# EAGLE design module (EAGLE 9.4.0)

## Sheet 1 of 2
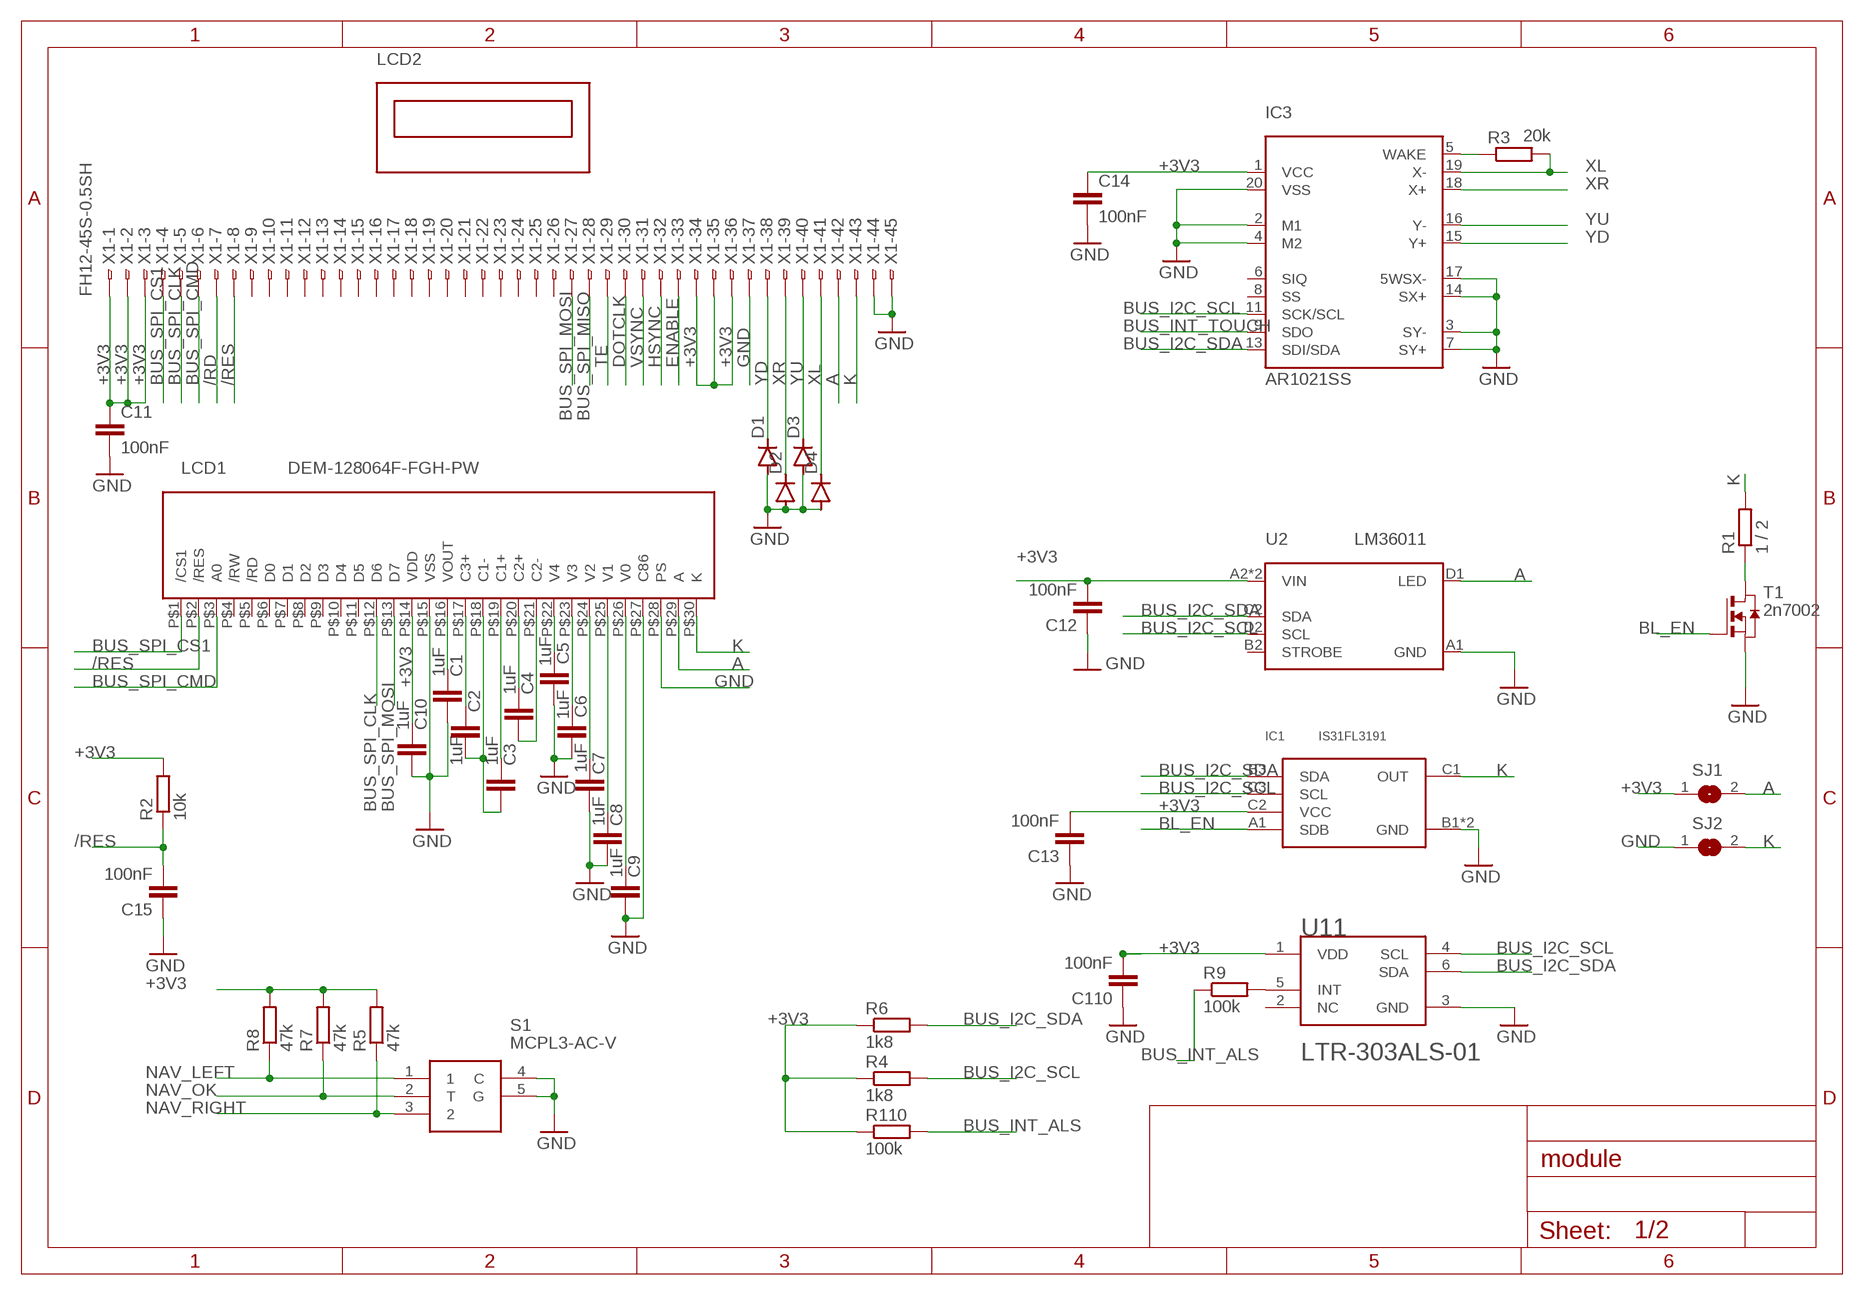
[diagram p0: schematic, sheet 1]

### Parts
C1  1uF  C-EUC0805  [C0805]
C2  1uF  C-EUC0805  [C0805]
C3  1uF  C-EUC0805  [C0805]
C4  1uF  C-EUC0805  [C0805]
C5  1uF  C-EUC0805  [C0805]
C6  1uF  C-EUC0805  [C0805]
C7  1uF  C-EUC0805  [C0805]
C8  1uF  C-EUC0805  [C0805]
C9  1uF  C-EUC0805  [C0805]
C10  1uF  C-EUC0805  [C0805]
C11  100nF  C-EUC0603  [C0603]
C12  100nF  C-EUC0603  [C0603]
C13  100nF  C-EUC0603  [C0603]
C14  100nF  C-EUC0603  [C0603]
C15  100nF  C-EUC0603  [C0603]
C110  100nF  C-EUC0603  [C0603]
D1  DIODE-SOD323-R  [SOD323-R]
D2  DIODE-SOD323-R  [SOD323-R]
D3  DIODE-SOD323-R  [SOD323-R]
D4  DIODE-SOD323-R  [SOD323-R]
IC1  IS31FL3191  [BGA9N40P3X3_133X133X56N]
IC3  AR1021SS  [SOP65P780X200-20N]
LCD1  DEM-128064F-FGH-PW  [DEM128064FFGH]
LCD2  DEM-230320K-TMH-PW  [DEM-240320K-TMH]
R1  1 / 2  R-EU_R0603  [R0603]
R2  10k  R-EU_R0603  [R0603]
R3  20k  R-EU_R0603  [R0603]
R4  1k8  R-EU_R0603  [R0603]
R5  47k  R-EU_R0603  [R0603]
R6  1k8  R-EU_R0603  [R0603]
R7  47k  R-EU_R0603  [R0603]
R8  47k  R-EU_R0603  [R0603]
R9  100k  R-EU_R0603  [R0603]
R110  100k  R-EU_R0603  [R0603]
S1  MCPL3-AC-V  [MCPL3-AC-V]
SJ1  SJ  [SJ]
SJ2  SJ  [SJ]
T1  2n7002  NMOSSOT23  [SOT-23]
U2  LM36011  [BGA8C35P2X4_151X80X50]
U11  LITE-ON_LTR-303ALS-01LITE-ON_LTR-303ALS-01_0_0  [LITE-ON_LTR-303ALS-01_0]
X1  FH12-45S-0.5SH  [FH12-45S-0.5SH]

### Nets
+3V3: C10.1 C11.1 C12.2 C13.2 C14.1 C110.2 IC1.C2(VCC) IC3.1(VCC) LCD1.P$14(VDD) R2.2 R4.1 R5.2 R6.1 R7.2 R8.2 R110.1 SJ1.1 U2.A2(VIN) U2.C1(VIN) U11.1(VDD) X1.1 X1.2 X1.3 X1.34 X1.35 X1.36 ; also sheet 2
/RD: X1.7
/RES: C15.2 LCD1.P$2(/RES) R2.1 X1.8
A: LCD1.P$29(A) SJ1.2 U2.D1(LED) X1.42
BL_EN: IC1.A1(SDB) T1.3(G)
BUS_I2C_SCL: IC1.C3(SCL) IC3.11(SCK/SCL) R4.2 U2.D2(SCL) U11.4(SCL)
BUS_I2C_SDA: IC1.B3(SDA) IC3.13(SDI/SDA) R6.2 U2.C2(SDA) U11.6(SDA)
BUS_INT_ALS: R9.1 R110.2
BUS_INT_TOUCH: IC3.9(SDO)
BUS_SPI_CLK: LCD1.P$12(D6) X1.5
BUS_SPI_CMD: LCD1.P$3(A0) X1.6
BUS_SPI_CS1: LCD1.P$1(/CS1) X1.4
BUS_SPI_MISO: X1.28
BUS_SPI_MOSI: LCD1.P$13(D7) X1.27
DOTCLK: X1.30
ENABLE: X1.33
GND: C1.2 C5.2 C6.2 C7.2 C8.2 C9.2 C10.2 C11.2 C12.1 C13.1 C14.2 C15.1 C110.1 D1.A D2.A D3.A D4.A IC1.B1(GND) IC1.B2(GND) IC3.2(M1) IC3.3(SY-) IC3.4(M2) IC3.7(SY+) IC3.14(SX+) IC3.17(5WSX-) IC3.20(VSS) LCD1.P$15(VSS) LCD1.P$27(C86) LCD1.P$28(PS) S1.4(C) S1.5(G) SJ2.1 T1.2(S) U2.A1(GND) U11.3(GND) X1.37 X1.44 X1.45 ; also sheet 2
HSYNC: X1.32
K: IC1.C1(OUT) LCD1.P$30(K) R1.2 SJ2.2 X1.43
N$1: C1.1 LCD1.P$16(VOUT)
N$2: C2.1 LCD1.P$17(C3+)
N$3: C2.2 C3.2 LCD1.P$18(C1-)
N$4: C3.1 LCD1.P$19(C1+)
N$5: C4.1 LCD1.P$20(C2+)
N$6: C4.2 LCD1.P$21(C2-)
N$7: C5.1 LCD1.P$22(V4)
N$8: C6.1 LCD1.P$23(V3)
N$9: C7.1 LCD1.P$24(V2)
N$10: C8.1 LCD1.P$25(V1)
N$11: C9.1 LCD1.P$26(V0)
N$14: R1.1 T1.1(D)
N$15: R9.2 U11.5(INT)
N$25: IC3.5(WAKE) R3.1
NAV_LEFT: R8.1 S1.1
NAV_OK: R7.1 S1.2(T)
NAV_RIGHT: R5.1 S1.3
TE: X1.29
VSYNC: X1.31
XL: D4.C IC3.19(X-) R3.2 X1.41
XR: D2.C IC3.18(X+) X1.39
YD: D1.C IC3.15(Y+) X1.38
YU: D3.C IC3.16(Y-) X1.40
Unconnected: IC3.6(SIQ) IC3.8(SS) LCD1.P$4(/RW) LCD1.P$5(/RD) LCD1.P$6(D0) LCD1.P$7(D1) LCD1.P$8(D2) LCD1.P$9(D3) LCD1.P$10(D4) LCD1.P$11(D5) U2.B2(STROBE) U11.2(NC) X1.9 X1.10 X1.11 X1.12 X1.13 X1.14 X1.15 X1.16 X1.17 X1.18 X1.19 X1.20 X1.21 X1.22 X1.23 X1.24 X1.25 X1.26

## Sheet 2 of 2
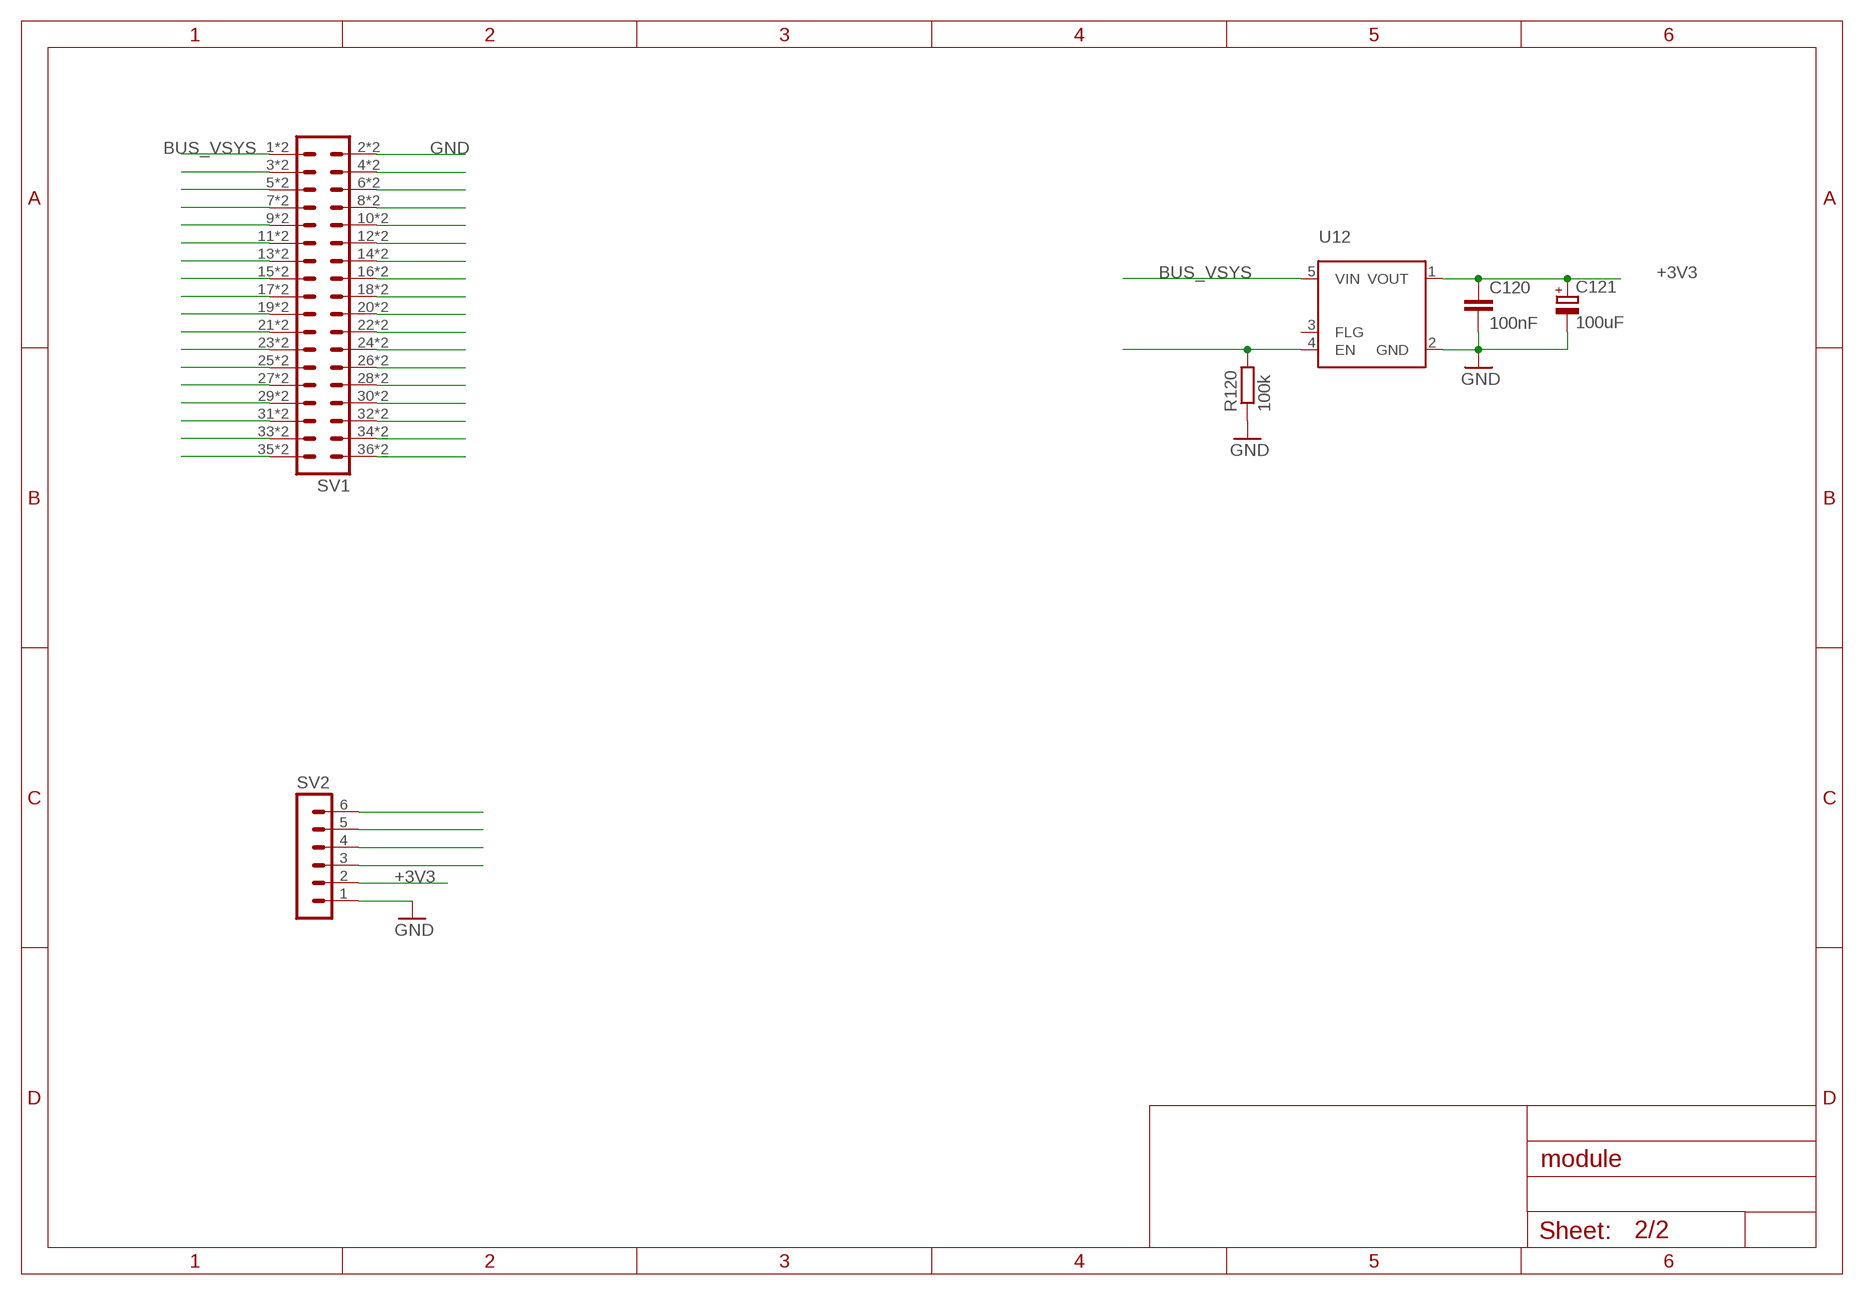
[diagram p1: schematic, sheet 2]

### Parts
C120  100nF  C-EUC0402  [C0402]
C121  100uF  CPOL-EUSMCC  [SMC_C]
R120  100k  R-EU_R0402  [R0402]
SV1  MA18-2SMT  [MA18-2-SMT]
SV2  CONN-1X6  [MA06-1]
U12  AP22802  [SOT25]

### Nets
+3V3: C120.1 C121.+ SV2.2 U12.1(VOUT) ; also sheet 1
BUS_VSYS: SV1.1 SV1.P$1 U12.5(VIN)
GND: C120.2 C121.- R120.1 SV1.2 SV1.P$2 SV2.1 U12.2(GND) ; also sheet 1
N$12: SV2.3
N$13: R120.2 U12.4(EN)
N$16: SV2.4
N$17: SV1.3 SV1.P$3
N$18: SV1.5 SV1.P$5
N$19: SV2.5
N$20: SV1.4 SV1.P$4
N$21: SV1.6 SV1.P$6
N$22: SV1.7 SV1.P$7
N$23: SV1.9 SV1.P$9
N$24: SV1.8 SV1.P$8
N$26: SV1.10 SV1.P$10
N$27: SV1.11 SV1.P$11
N$28: SV1.13 SV1.P$13
N$29: SV1.15 SV1.P$15
N$30: SV1.12 SV1.P$12
N$31: SV1.14 SV1.P$14
N$32: SV1.16 SV1.P$16
N$33: SV1.17 SV1.P$17
N$34: SV1.19 SV1.P$19
N$35: SV1.18 SV1.P$18
N$36: SV1.20 SV1.P$20
N$37: SV1.21 SV1.P$21
N$38: SV1.23 SV1.P$23
N$39: SV1.25 SV1.P$25
N$40: SV1.22 SV1.P$22
N$41: SV1.24 SV1.P$24
N$42: SV1.26 SV1.P$26
N$43: SV1.27 SV1.P$27
N$44: SV1.29 SV1.P$29
N$45: SV1.28 SV1.P$28
N$46: SV1.30 SV1.P$30
N$47: SV1.31 SV1.P$31
N$48: SV1.33 SV1.P$33
N$49: SV1.32 SV1.P$32
N$50: SV1.34 SV1.P$34
N$51: SV1.35 SV1.P$35
N$52: SV1.36 SV1.P$36
N$53: SV2.6
Unconnected: U12.3(FLG)

## Library data of the parts
C1-C15 C110 C120 = rcl:C-EU: CAPACITOR, European symbol; SPICEPREFIX: C
C121 = rcl:CPOL-EU: POLARIZED CAPACITOR, European symbol; SPICEPREFIX: C
D1-D4 = diode:DIODE-: DIODE
IC1 = issi:IS31FL3191
IC3 = microchip:AR1021
LCD1 = parts-display-elektronic:DEM-128064F-FGH-PW
LCD2 = display-elektronic:DEM-230320K-TMH-PW
R1-R9 R110 R120 = rcl:R-EU_: RESISTOR, European symbol; SPICEPREFIX: R
S1 = multicomp:MCPL3-AC-V: MULTICOMP - MCPL3-AC-V - NAVIGATION SWITCH, 3WAY, SMD Source: Datasheet <http://www.farnell.com/datasheets/1673648.pdf>; ARROW_PART_NUMBER: MCPL3-AC-V; DESCRIPTION: MULTICOMP - MCPL3-AC-V - NAVIGATION SWITCH, 3WAY, SMD; HEIGHT: mm; MANUFACTURER_NAME: MULTICOMP; MANUFACTURER_PART_NUMBER: MCPL3-AC-V
SJ1 SJ2 = jumper:SJ: SMD solder JUMPER
SV1 = parts-passives:MA18-2: PIN HEADER
SV2 = parts-passives:CONN-1X6
T1 = zetex:NMOSSOT23: MOS FET; OC_FARNELL: unknown; OC_NEWARK: unknown
U2 = parts-ti:LM36011
U11 = Lite-On:LITE-ON_LTR-303ALS-01: Digital Ambient Light Sensor 6-Pin SMD T/R; CENTROID_NOT_SPECIFIED: No; DATASHEET: http://optoelectronics.liteon.com/upload/download/DS86-2013-0004/LTR-303ALS-01_DS_V1.pdf; DIGIKEY_DESCRIPTION: IC AMBIENT LIGHT PHOTO SENSOR; DIGIKEY_PART_NUMBER: 160-2161-1-ND; IPC_LAND_PATTERN_NAME: CAPC200125X45; LEAD_FREE: yes; MF: Lite-On; MFG_PACKAGE_IDENT: LTR-303ALS-01; MOUSER_DESCRIPTION: Ambient Light Sensors Ambient Light Photo Sensor; MOUSER_PART_NUMBER: 859-LTR-303ALS-01; MPN: LTR-303ALS-01; PACKAGE: SENSOR_SMD; PREFIX: U; ROHS: yes; TEMPERATURE_RANGE_HIGH: +70°C; TEMPERATURE_RANGE_LOW: -30°C
U12 = parts-diodes:AP22802
X1 = con-hirose:FH12-45S-0.5S: 0.5mm Pitch Connectors For FPC/FFC Source: Data sheet <http://www.hirose.co.jp/cataloge_hp/e58605370.pdf>; OC_FARNELL: unknown; OC_NEWARK: unknown

## Board
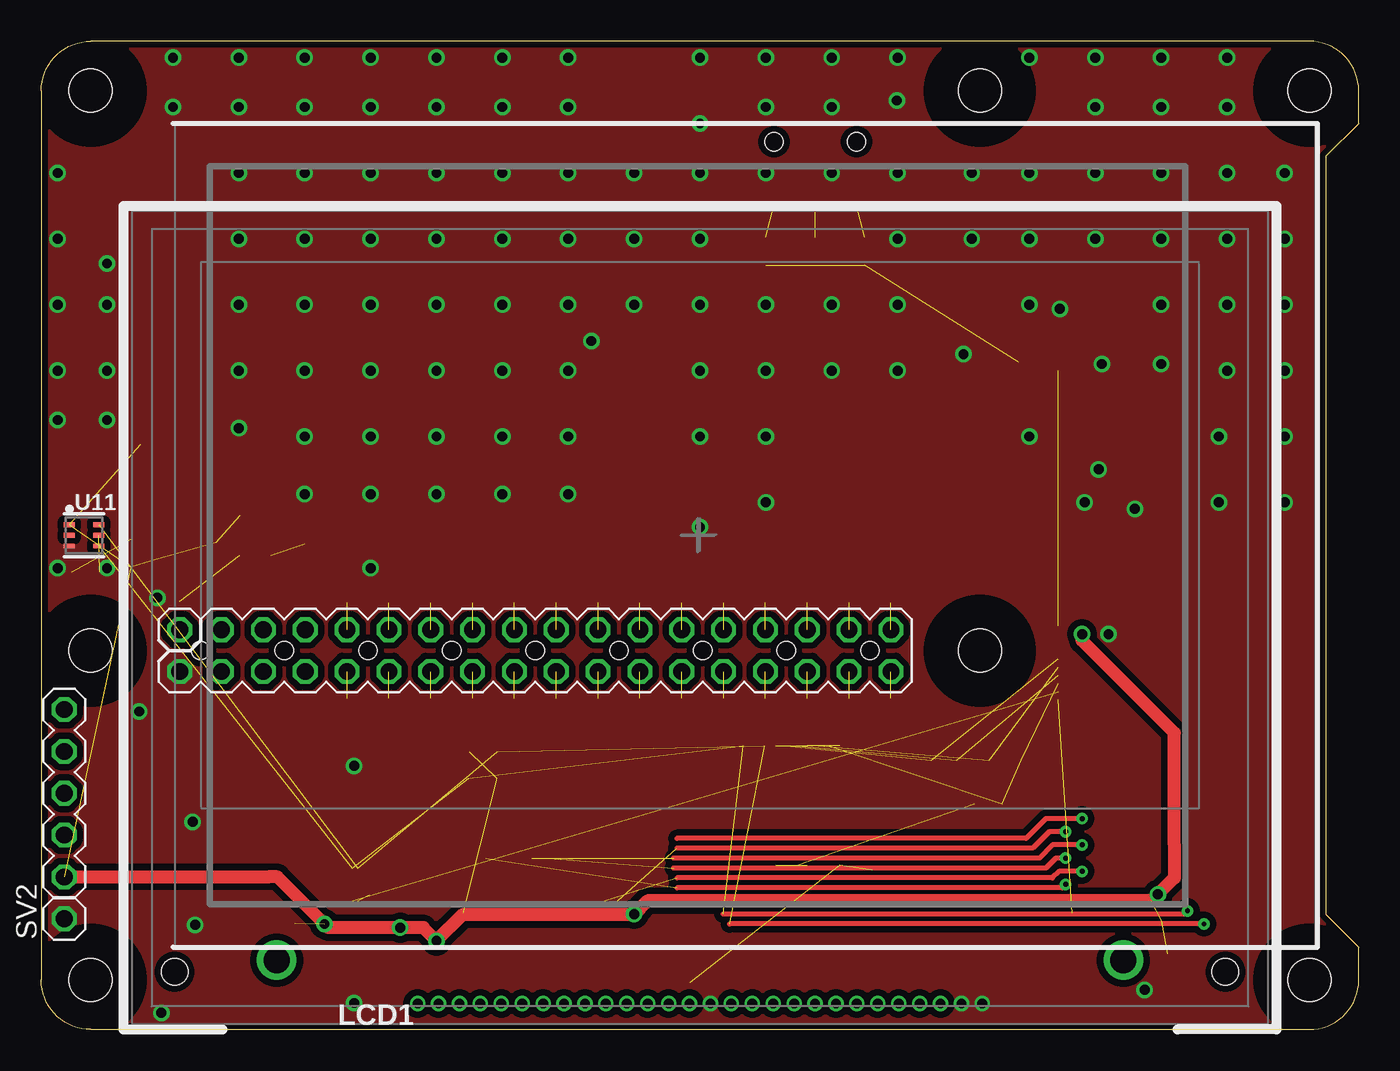
[diagram p2: board, top side]
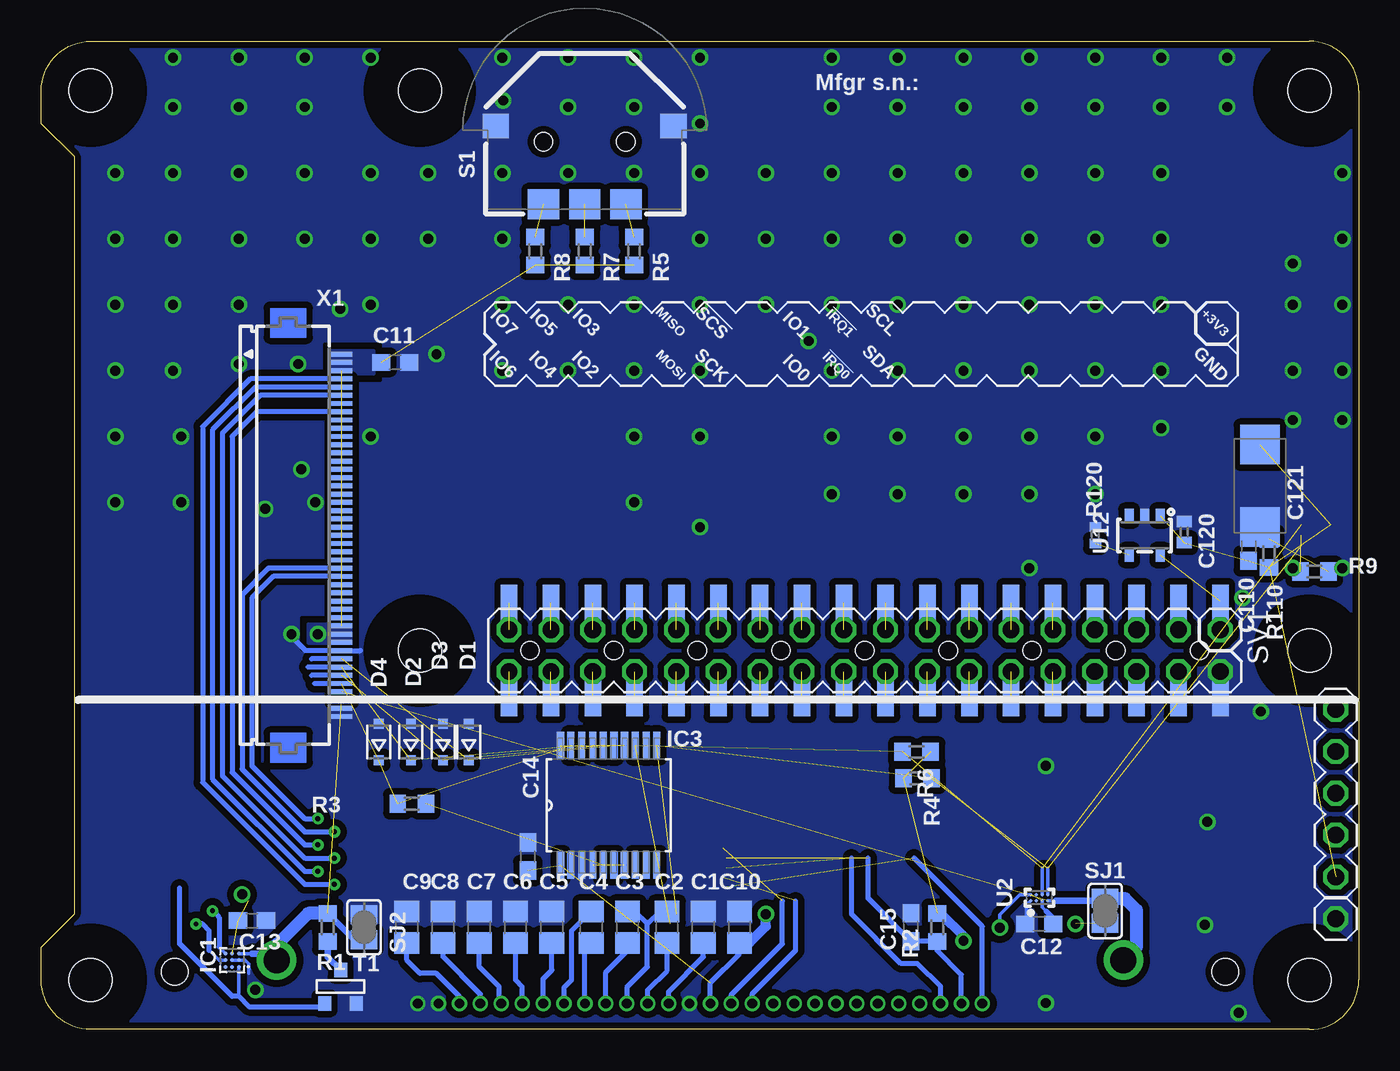
[diagram p3: board, bottom side, seen from below]

Size 80 x 60 mm. Coordinates in mm from the lower left corner, seen from the top.
Outline: 3,0 77,0 arc90 80,3 80,5 78,7 78,53 80,55 80,57 arc90 77,60 3,60 arc90 0,57 0,3 arc90 3,0
Copper layers (1*16): Top 0.035mm / dielectric 1mm / Bottom 0.035mm
Design rules "default *": minimum track width 0.2mm, minimum drill 0.3mm, track to track 0.2mm, track to pad 0.2mm, pad to pad 0.2mm, via to via 0.2mm, smd to smd 6mil, copper to edge 0.4mm, drill to drill 0.2mm, minimum pad ring 0.16mm, minimum via ring 0.2mm, stop-mask expansion 0.1mm, vias tented up to drill 0mil, thermal gap 10mil
Holes 2.6 mm at 3,3 77,3 57,23 3,57 77,57 3,23 57,57
tRestrict: area 0,0 to 6,6; area 74,0 to 80,6; area 54,20 to 60,26; area 0,54 to 6,60; area 74,54 to 80,60; area 0,20 to 6,26; area 54,54 to 60,60
bRestrict: area 0,0 to 6,6; area 74,0 to 80,6; area 54,20 to 60,26; area 0,54 to 6,60; area 74,54 to 80,60; area 0,20 to 6,26; area 54,54 to 60,60

### Footprints (pad centres in the part's own frame; a part is rotated, then mirrored left to right if it is on the bottom)
C0805 = smd 1.3 x 1.5: 1 -0.95,0; 2 0.95,0
C0603 = smd 1.1 x 1: 1 -0.85,0; 2 0.85,0
C0402 = smd 0.7 x 0.9: 1 -0.65,0; 2 0.65,0
SMC_C = smd 2.4 x 2.4: + -2.5,0; - 2.5,0
SOD323-R = smd 0.6 x 0.6: A 1.1,0; C -1.1,0
BGA9N40P3X3_133X133X56N = smd 0.25 x 0.25: A1 -0.4,0.4; A2 0,0.4; A3 0.4,0.4; B1 -0.4,0; B2 0,0; B3 0.4,0; C1 -0.4,-0.4; C2 0,-0.4; C3 0.4,-0.4
SOP65P780X200-20N = smd 1.651 x 0.432: 1 -3.632,2.921; 2 -3.632,2.286; 3 -3.632,1.626; 4 -3.632,0.965; 5 -3.632,0.33; 6 -3.632,-0.33; 7 -3.632,-0.965; 8 -3.632,-1.626; 9 -3.632,-2.286; 10 -3.632,-2.921; 11 3.632,-2.921; 12 3.632,-2.286; 13 3.632,-1.626; 14 3.632,-0.965; 15 3.632,-0.33; 16 3.632,0.33; 17 3.632,0.965; 18 3.632,1.626; 19 3.632,2.286; 20 3.632,2.921
DEM128064FFGH = drill 0.6 pad 0.9: P$1 -17.145,-23.43; P$2 -15.875,-23.43; P$3 -14.605,-23.43; P$4 -13.335,-23.43; P$5 -12.065,-23.43; P$6 -10.795,-23.43; P$7 -9.525,-23.43; P$8 -8.255,-23.43; P$9 -6.985,-23.43; P$10 -5.715,-23.43; P$11 -4.445,-23.43; P$12 -3.175,-23.43; P$13 -1.905,-23.43; P$14 -0.635,-23.43; P$15 0.635,-23.43; P$16 1.905,-23.43; P$17 3.175,-23.43; P$18 4.445,-23.43; P$19 5.715,-23.43; P$20 6.985,-23.43; P$21 8.255,-23.43; P$22 9.525,-23.43; P$23 10.795,-23.43; P$24 12.065,-23.43; P$25 13.335,-23.43; P$26 14.605,-23.43; P$27 15.875,-23.43; P$28 17.145,-23.43 | drill 1.6 pad 2.4: P$29 -25.7,-20.8; P$30 25.7,-20.8 | hole 1.6: -31.9,-21.5; 31.9,-21.5
R0603 = smd 1 x 1.1: 1 -0.85,0; 2 0.85,0
R0402 = smd 0.6 x 0.7: 1 -0.5,0; 2 0.5,0
MCPL3-AC-V = smd 1.9 x 1.8: 1 -2.5,-0.9; 2 0,-0.9; 3 2.5,-0.9 | smd 1.6 x 1.5: 4 5.4,3.85; 5 -5.4,3.85 | hole 1.1: -2.5,2.9; 2.5,2.9
SJ = smd 1.168 x 1.6: 1 -0.762,0; 2 0.762,0
MA18-2-SMT = drill 1.016 pad 1.5 octagon: 1 -21.59,-1.27; 2 -21.59,1.27; 3 -19.05,-1.27; 4 -19.05,1.27; 5 -16.51,-1.27; 6 -16.51,1.27; 7 -13.97,-1.27; 8 -13.97,1.27; 9 -11.43,-1.27; 10 -11.43,1.27; 11 -8.89,-1.27; 12 -8.89,1.27; 13 -6.35,-1.27; 14 -6.35,1.27; 15 -3.81,-1.27; 16 -3.81,1.27; 17 -1.27,-1.27; 18 -1.27,1.27; 19 1.27,-1.27; 20 1.27,1.27; 21 3.81,-1.27; 22 3.81,1.27; 23 6.35,-1.27; 24 6.35,1.27; 25 8.89,-1.27; 26 8.89,1.27; 27 11.43,-1.27; 28 11.43,1.27; 29 13.97,-1.27; 30 13.97,1.27; 31 16.51,-1.27; 32 16.51,1.27; 33 19.05,-1.27; 34 19.05,1.27; 35 21.59,-1.27; 36 21.59,1.27 | smd 1 x 2.2: P$1 -21.59,-2.9; P$2 -21.59,2.9; P$3 -19.05,-2.9; P$4 -19.05,2.9; P$5 -16.51,-2.9; P$6 -16.51,2.9; P$7 -13.97,-2.9; P$8 -13.97,2.9; P$9 -11.43,-2.9; P$10 -11.43,2.9; P$11 -8.89,-2.9; P$12 -8.89,2.9; P$13 -6.35,-2.9; P$14 -6.35,2.9; P$15 -3.81,-2.9; P$16 -3.81,2.9; P$17 -1.27,-2.9; P$18 -1.27,2.9; P$19 1.27,-2.9; P$20 1.27,2.9; P$21 3.81,-2.9; P$22 3.81,2.9; P$23 6.35,-2.9; P$24 6.35,2.9; P$25 8.89,-2.9; P$26 8.89,2.9; P$27 11.43,-2.9; P$28 11.43,2.9; P$29 13.97,-2.9; P$30 13.97,2.9; P$31 16.51,-2.9; P$32 16.51,2.9; P$33 19.05,-2.9; P$34 19.05,2.9; P$35 21.59,-2.9; P$36 21.59,2.9 | hole 1.1: -20.32,0; -15.24,0; -5.08,0; 0,0; 5.08,0; 20.32,0; -10.16,0; 10.16,0; 15.24,0
MA06-1 = drill 1.016 pad 1.5 octagon: 1 -5.08,0; 2 -2.54,0; 3 0,0; 4 2.54,0; 5 5.08,0; 6 7.62,0
SOT-23 = smd 0.787 x 0.889: 1 0.025,-1.016; 2 -0.94,1.016; 3 0.991,1.016
BGA8C35P2X4_151X80X50 = smd 0.2 x 0.2: A1 -0.175,0.525; A2 0.175,0.525; B1 -0.175,0.175; B2 0.175,0.175; C1 -0.175,-0.175; C2 0.175,-0.175; D1 -0.175,-0.525; D2 0.175,-0.525
LITE-ON_LTR-303ALS-01_0 = smd 0.3 x 0.65: 1 -0.65,-0.9; 2 0,-0.9; 3 0.65,-0.9; 4 0.65,0.9; 5 0,0.9; 6 -0.65,0.9
SOT25 = smd 0.55 x 0.8: 1 -0.95,-1.2; 2 0,-1.2; 3 0.95,-1.2; 4 0.95,1.2; 5 -0.95,1.2
FH12-45S-0.5SH = smd 0.3 x 1.3: 1 -13,3.25; 2 -12.5,3.25; 3 -12,3.25; 4 -11.5,3.25; 5 -11,3.25; 6 -10.5,3.25; 7 -10,3.25; 8 -9.5,3.25; 9 -9,3.25; 10 -8.5,3.25; 11 -8,3.25; 12 -7.5,3.25; 13 -7,3.25; 14 -6.5,3.25; 15 -6,3.25; 16 -5.5,3.25; 17 -5,3.25; 18 -4.5,3.25; 19 -4,3.25; 20 -3.5,3.25; 21 -3,3.25; 22 -2.5,3.25; 23 -2,3.25; 24 -1.5,3.25; 25 -1,3.25; 26 -0.5,3.25; 27 0,3.25; 28 0.5,3.25; 29 1,3.25; 30 1.5,3.25; 31 2,3.25; 32 2.5,3.25; 33 3,3.25; 34 3.5,3.25; 35 4,3.25; 36 4.5,3.25; 37 5,3.25; 38 5.5,3.25; 39 6,3.25; 40 6.5,3.25; 41 7,3.25; 42 7.5,3.25; 43 8,3.25; 44 8.5,3.25; 45 9,3.25

### Placement (x,y rotation side)
C1  39.8,6.2 90 bottom
C2  42,6.2 90 bottom
C3  44.4,6.2 90 bottom
C4  46.6,6.2 90 bottom
C5  49,6.2 90 bottom
C6  51.2,6.2 90 bottom
C7  53.4,6.2 90 bottom
C8  55.6,6.2 90 bottom
C9  57.8,6.2 90 bottom
C10  37.6,6.2 90 bottom
C11  58.5,40.5 0 bottom
C12  19.4,6.4 0 bottom
C13  67.2,6.6 180 bottom
C14  50.45,10.5 90 bottom
C15  27.2,6.2 270 bottom
C110  6.7,29.3 270 bottom
C120  10.6,30.2 90 bottom
C121  6,33 270 bottom
D1  54.05,17.45 90 bottom
D2  57.55,17.45 90 bottom
D3  55.6,17.45 90 bottom
D4  59.5,17.45 90 bottom
IC1  68.4,4.2 180 bottom
IC3  45.55,13.6 90 bottom
LCD1  40,25 0 top
LCD2  42.75,30 90 top
R1  62.6,6.2 90 bottom
R2  25.6,6.2 90 bottom
R3  57.5,13.7 180 bottom
R4  26.8,15.25 0 bottom
R5  44,47.25 270 bottom
R6  26.85,16.85 180 bottom
R7  47,47.25 270 bottom
R8  50,47.25 270 bottom
R9  2.7,27.8 180 bottom
R110  5.45,28.9 90 bottom
R120  16,30 270 bottom
S1  47,51 0 bottom
SJ1  15.4,7.2 90 bottom
SJ2  60.4,6.2 270 bottom
SV1  30,23 180 bottom
SV2  1.4,11.8 90 top
T1  61.8,2.6 180 bottom
U2  19.4,8 90 bottom
U11  2.6,30 270 top
U12  13,30 180 bottom
X1  65,28 270 bottom

### Tracks (layer width: path | path; a pad name or v marks a point on that pad's centre or on a via)
+3V3  (via drill 0.6)  (18 unrouted)
  Top 0.8: v63.2,24 63.2,23.6 68.8,18 68.8,11.2 68.8,9.2 v67.8,8.2 67.4,7.8 64,7.8 36.8,7.8 v36,7 35.98,6.97 25.6,6.97 v24,5.38 23.2,6.17 v21.8,6.17 17.43,6.17 v17.2,6.4 14.34,9.26 13.8,9.26 SV2.2
  Bottom 0.2: U2.C1 19.23,7.42 19,7.2 | v21.8,6.17 21.8,6.97 20.6,8.18 U2.A2
  Bottom 0.3: LCD1.P$14 39.37,2.83 37.6,4.6 C10.1 | 19,7.2 18.55,6.75 C12.2
  Bottom 0.6: C10.1 37,5.25 36,6.25 v36,7 | R2.2 25.4,7.05 24,5.65 v24,5.38
  Bottom 0.8: 18.51,6.44 C12.2
  pour Bottom (no thermals): 61.2,23.4 63.8,23.4 63.8,24.6 61.2,24.6
  pour Bottom (isolate 0.3, no thermals): 59.8,39.8 62.4,39.8 62.4,41.2 59.8,41.2
/RES  (via drill 0.3)  (1 unrouted)
  Top 0.3: v63.2,11.2 61.4,11.2 60.6,10.4 38.4,10.4
  Bottom 0.3: LCD1.P$2 24.12,3.33 25.6,4.8 R2.1 C15.2 29.8,7.95 29.8,10.4 | X1.8 66.9,37.5 68.4,36 68.4,15.6 64,11.2 v63.2,11.2
A  (1 unrouted)
  Bottom 0.2: U2.D1 18.4,7.83
  Bottom 0.4: 18.4,7.83 15.54,7.83 SJ1.2
  Bottom 0.8: SJ1.2 14.2,7.96 13.5,7.26 13.5,5 LCD1.P$29
BL_EN
  Bottom 0.2: IC1.A1 68,2
  Bottom 0.3: T1.3 62.99,1.38 67.38,1.38 68,2 68.4,2 71.6,5.2 71.6,8.6
BUS_I2C_SCL  (via drill 0.3)  (4 unrouted)
  Top 0.3: v69.6,7.2 69.4,7 41.4,7
  Bottom 0.2: U2.D2 18.88,9.8 | IC1.C3 69.2,5
  Bottom 0.3: 69.2,5 69.2,6.8 v69.6,7.2
BUS_I2C_SDA  (via drill 0.3)  (4 unrouted)
  Top 0.3: v70.6,6.4 41.8,6.4
  Bottom 0.2: U2.C2 19.23,9.8 | IC1.B3 69.2,4.2 69.8,4.8
  Bottom 0.3: 69.8,4.8 69.8,6 70.2,6.4 v70.6,6.4
BUS_INT_ALS  (1 unrouted)
BUS_SPI_CLK  (via drill 0.3)  (1 unrouted)
  Top 0.3: v63.2,9.6 61.8,9.6 61.4,9.2 38.6,9.2
  Bottom 0.3: 34.2,7.8 34.2,4.8 36.83,2.17 LCD1.P$12 | X1.5 67,39 69.6,36.4 69.6,15.2 64,9.6 v63.2,9.6
BUS_SPI_CMD  (via drill 0.3)  (1 unrouted)
  Top 0.3: v62.2,10.4 61.6,10.4 61,9.8 38.4,9.8
  Bottom 0.3: 30.8,10.4 30.8,7 27.8,4 26.8,4 25.39,2.6 LCD1.P$3 | X1.6 66.7,38.5 69,36.2 69,15.4 64,10.4 v62.2,10.4
BUS_SPI_CS1  (via drill 0.3)  (1 unrouted)
  Top 0.3: v62.2,8.8 62,8.6 38.6,8.6
  Bottom 0.3: LCD1.P$1 22.86,6.25 27,10.4 | X1.4 67.3,39.5 70.2,36.6 70.2,15 64,8.8 v62.2,8.8
BUS_SPI_MISO  (via drill 0.3)
  Top 0.3: v63.2,12.8 61,12.8 59.8,11.6 38.6,11.6
  Bottom 0.3: X1.28 65.9,27.5 67.2,26.2 67.2,16 64,12.8 v63.2,12.8
BUS_SPI_MOSI  (via drill 0.3)  (1 unrouted)
  Top 0.3: v62.2,12 61.2,12 60.2,11 38.6,11
  Bottom 0.3: LCD1.P$13 38.09,2.1 35,5.2 35,7.8 | X1.27 66.2,28 67.8,26.4 67.8,15.8 64,12 v62.2,12
BUS_VSYS  (1 unrouted)
  Bottom 0.8: SV1.1 SV1.P$1 | SV1.P$1 8.41,26 SV1.P$1
GND  (via drill 0.6)  (3 unrouted)
  Bottom 0.2: IC1.B2 IC1.B1 | IC1.B1 67.83,4.2 | IC1.B1 67.6,4.2 67.4,4 67.4,3.4 | U2.A1 20.2,7.55 20.2,6.45 C12.1
  Bottom 0.3: 60.6,23 X1.37 63.95,23 64.8,23.85 v64.8,24
  other vias: 1,37 1,40 1,44 1,48 1,52 4,46.5 16,36 16,40 16,44 12,36.5 12,40 12,44 12,48 16,48 20,36 20,40 20,44 20,48 24,48 24,36 24,40 24,44 28,36 28,40 28,44 32,36 32,40 32,44 33.4,41.8 36,44 40,36 40,40 40,44 44,36 44,40 44,44 48,40 48,44 52,40 52,44 56,41 60,36 60,44 28,48 28,52 28,56 32,48 32,52 32,56 36,48 36,52 40,48 40,52 44,52 44,56 48,52 48,56 4,28 7.05,26.2 1,28 16,32.5 20,28 20,32.5 24,32.5 9.35,6.35 9.2,12.6 7.3,1 19,1.6 19,16 28,32.5 32,32.5 40,30.5 44,32 75.5,32 71.5,32 75.5,36 71.5,36 75.5,40 72,40 66.4,31.6 63.35,32 64.2,34 61.85,43.75 68,40.4 64.4,40.4 75.5,44 72,44 75.5,48 72,48 75.5,52 72,52 68,44 68,48 68,52 68,56 64,56 64,48 60,48 64,52 60,52 72,56 56.5,48 56.5,52 60,59 64,59 68,59 72,59 52,52 52,48 51.95,56.4 52,59 48,59 44,59 40,59 40,55 32,59 28,59 12,52 12,56 12,59 16,52 16,56 16,59 20,52 20,56 20,59 24,52 24,56 24,59 8,59 8,56 5.95,19.3 4,37 4,40 4,44 67,2.4
  pour Bottom (isolate 0.4, rank 6, no thermals): -2,-2 -2,62 82,62 82,-2
  pour Top (isolate 0.4, no thermals): -4,-4 -4,64 84,64 84,-4
K  (1 unrouted)
  Bottom 0.2: IC1.C1 67.2,4.6
  Bottom 0.4: 67.2,4.6 66.1,4.6 LCD1.P$30 | SJ2.2 61,5.44 62.6,7.04 R1.2
  Bottom 0.8: R1.2 63.8,7.05 65.7,5.15 LCD1.P$30
N$1
  Bottom 0.3: C1.1 39.8,4.4 41.91,2.29 LCD1.P$16
N$2
  Bottom 0.3: LCD1.P$17 43.17,2.4 42,3.58 C2.1
N$3
  Bottom 0.25: LCD1.P$18 44.45,2.4 44.45,2.56
  Bottom 0.3: 43.2,6.4 43.2,3.8 44.45,2.56 LCD1.P$18 | 43.2,6.4 43.95,7.15 C3.2 | 43.2,6.4 42.45,7.15 C2.2
N$4
  Bottom 0.3: C3.1 44.4,4.8 45.72,3.48 LCD1.P$19
N$5
  Bottom 0.3: C4.1 46.98,4.87 LCD1.P$20
N$6
  Bottom 0.3: LCD1.P$21 48.26,2.54 47.8,3 47.8,6 46.65,7.15 C4.2
N$7
  Bottom 0.3: C5.1 49,3.6 49.52,3.08 LCD1.P$22
N$8
  Bottom 0.3: LCD1.P$23 50.8,2.6 51.2,3 C6.1
N$9
  Bottom 0.3: LCD1.P$24 52.06,1.86 52.2,2 52.2,2.6 53.4,3.8 C7.1
N$10
  Bottom 0.3: C8.1 55.6,4.4 53.34,2.13 LCD1.P$25
N$11
  Bottom 0.3: C9.1 57.8,4.2 57,3.4 56,3.4 54.6,2 LCD1.P$26
N$13  (1 unrouted)
N$14
  Bottom 0.4: T1.1 62.6,4.39 R1.1
N$15  (1 unrouted)
N$17
  Bottom 0.8: SV1.3 SV1.P$3
N$18
  Bottom 0.8: SV1.5 SV1.P$5
N$20
  Bottom 0.8: SV1.4 SV1.P$4
N$21
  Bottom 0.8: SV1.6 SV1.P$6
N$22
  Bottom 0.8: SV1.7 SV1.P$7
N$23  (1 unrouted)
N$24
  Bottom 0.8: SV1.8 SV1.P$8
N$25  (1 unrouted)
N$26  (1 unrouted)
N$27  (1 unrouted)
N$28  (1 unrouted)
N$29  (1 unrouted)
N$30  (1 unrouted)
N$31  (1 unrouted)
N$32  (1 unrouted)
N$33  (1 unrouted)
N$34  (1 unrouted)
N$35  (1 unrouted)
N$36  (1 unrouted)
N$37  (1 unrouted)
N$38  (1 unrouted)
N$39  (1 unrouted)
N$40  (1 unrouted)
N$41  (1 unrouted)
N$42  (1 unrouted)
N$43  (1 unrouted)
N$44  (1 unrouted)
N$45  (1 unrouted)
N$46  (1 unrouted)
N$47  (1 unrouted)
N$48  (1 unrouted)
N$49  (1 unrouted)
N$50  (1 unrouted)
N$51  (1 unrouted)
N$52  (1 unrouted)
NAV_LEFT  (1 unrouted)
NAV_OK  (1 unrouted)
NAV_RIGHT  (1 unrouted)
XL  (3 unrouted)
  Bottom 0.3: X1.41 63.4,21
XR  (2 unrouted)
  Bottom 0.3: X1.39 63.8,22
YD  (2 unrouted)
  Bottom 0.3: X1.38 63.6,22.5
YU  (2 unrouted)
  Bottom 0.3: X1.40 63.6,21.5

### Text on the board
bPlace: Mfgr s.n.: | SCL | IO3 | IO5 | IO7 | +3V3 | !IRQ1 | IO1 | !SCS | MISO | GND | SDA | !IRQ0 | IO0 | SCK | MOSI | IO2 | IO4 | IO6